# Altium schematic sheet 02MCU.SchDoc
size A3; SheetNumber: 2
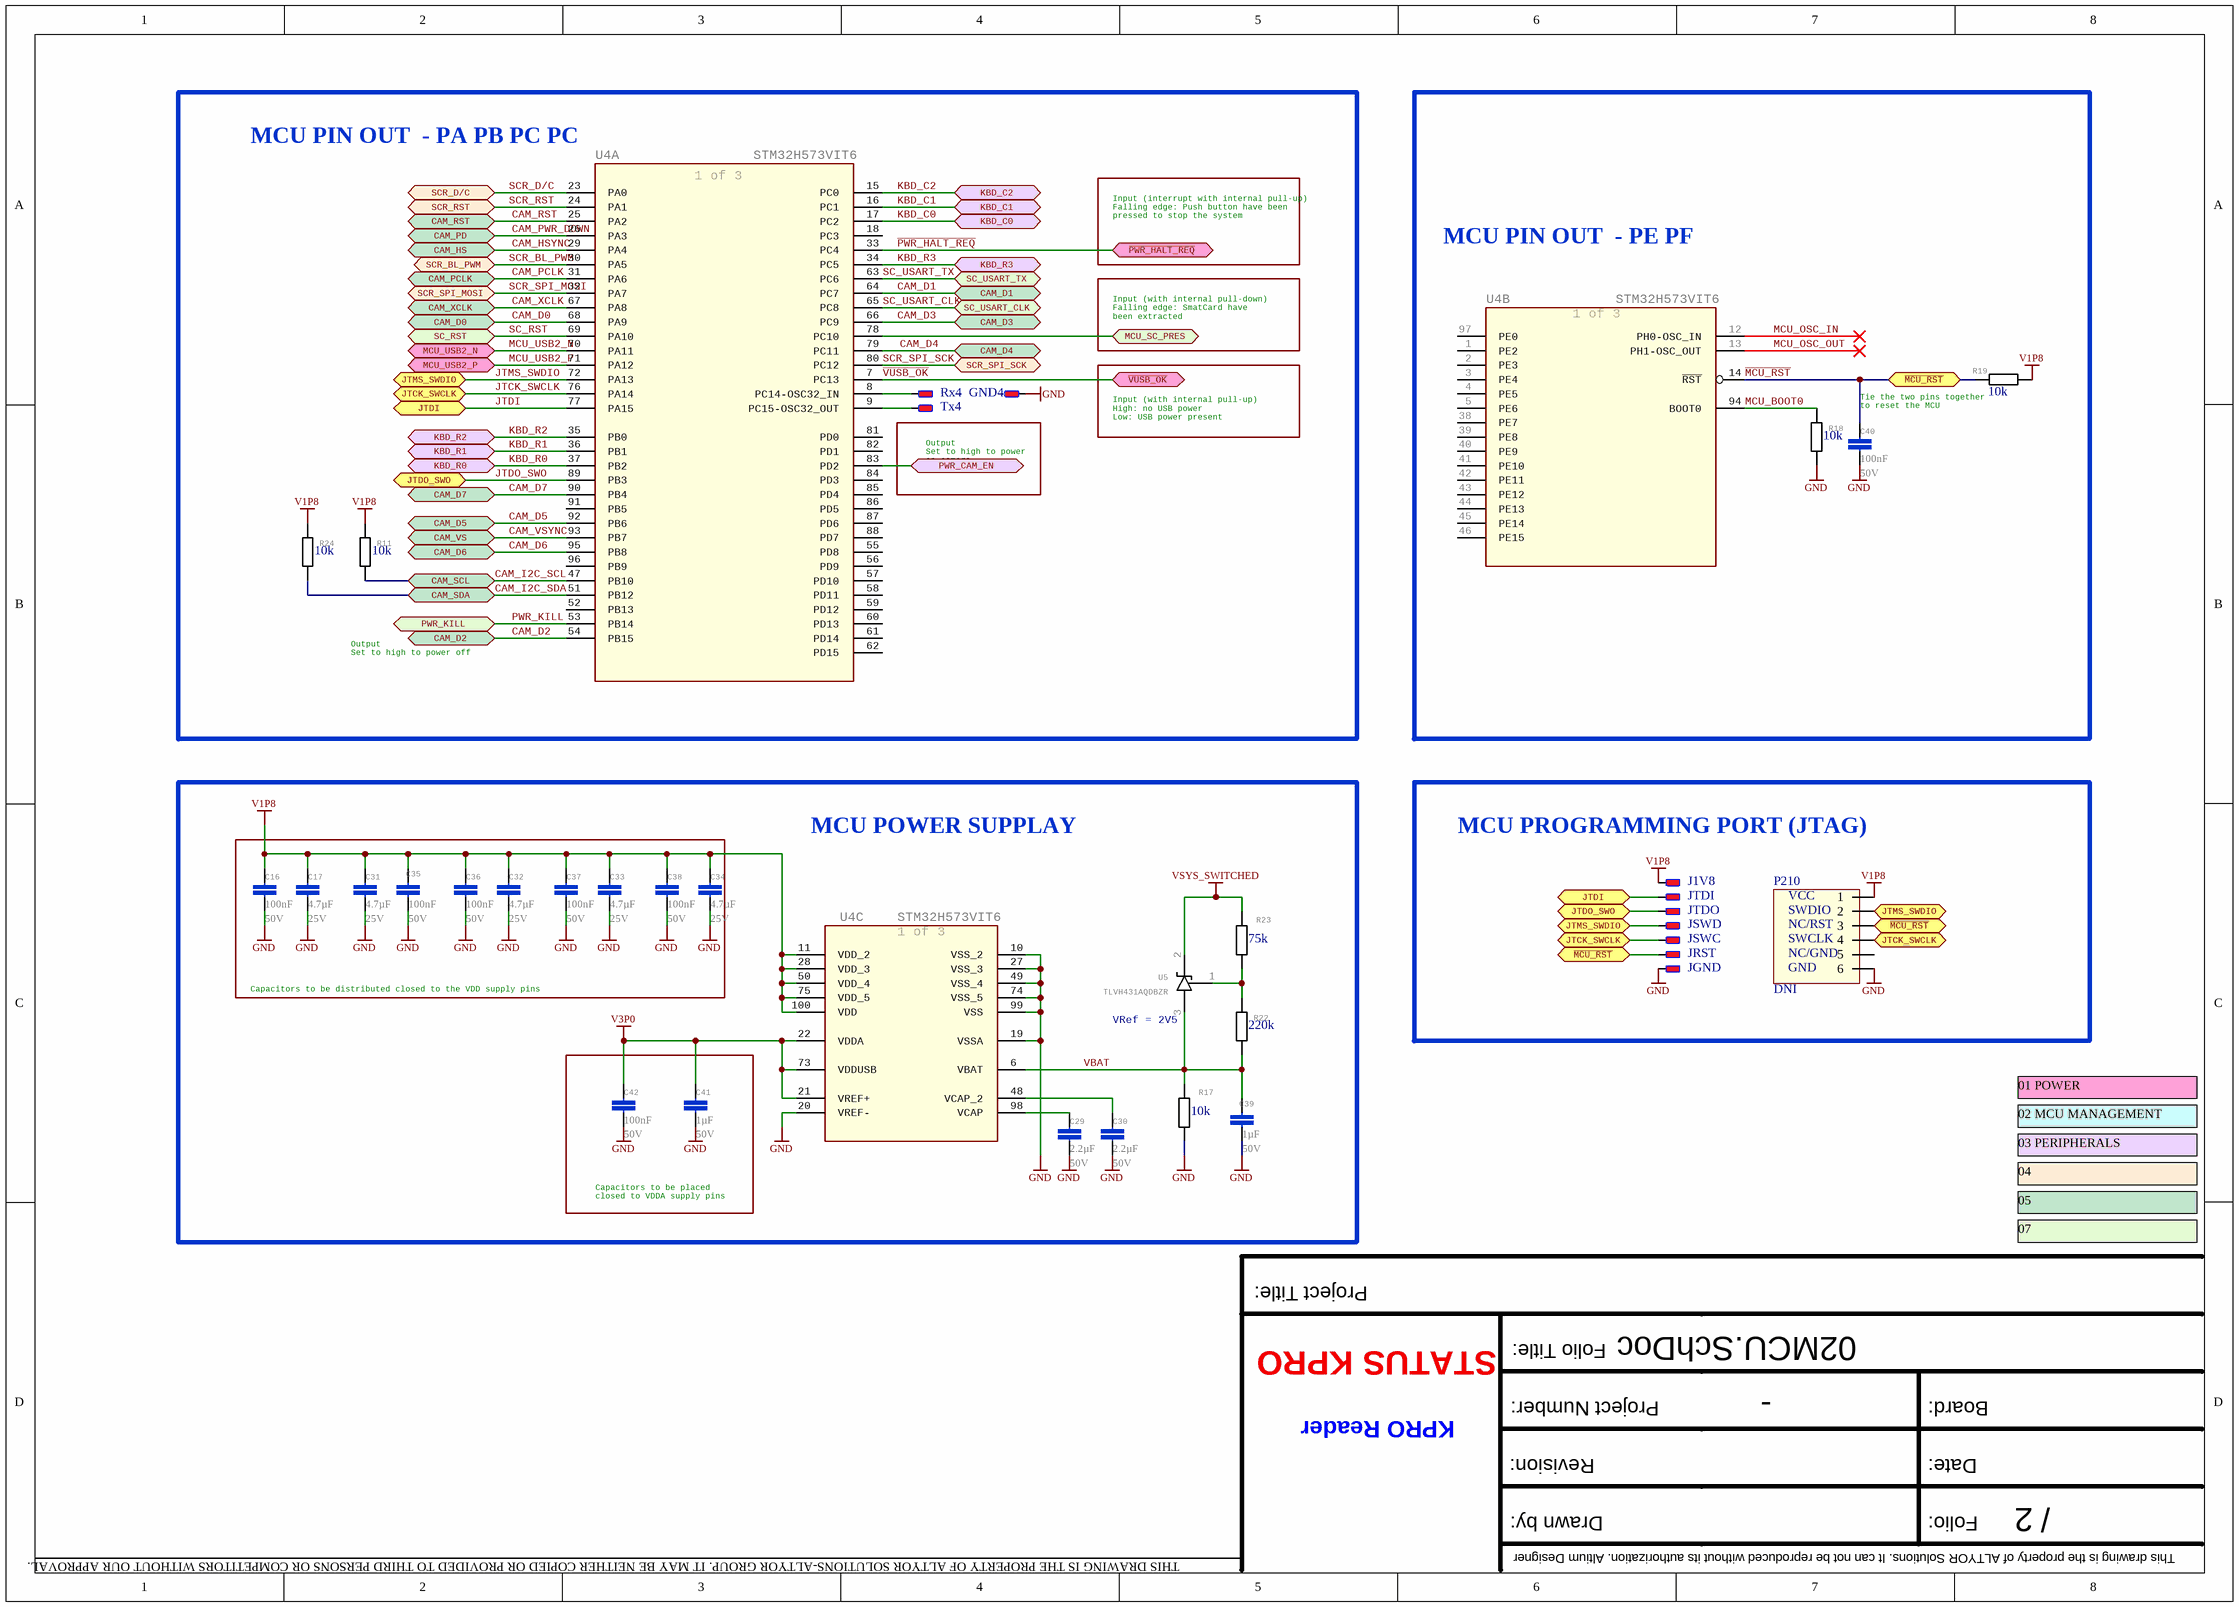
[diagram p0: 02MCU.SchDoc]

## Parts
C16  VOLTAGE: 50V  NAME: 100nF  [0402 - CAPACITOR]  (hidden comment: 0402B104K500CT)
C17  VOLTAGE: 25V  NAME: 4.7µF  [0805 - CAPACITOR]  (hidden comment: 0805X475M250CT)
C29  VOLTAGE: 50V  NAME: 2.2µF  [0805 - CAPACITOR]  (hidden comment: 805X225M500CT)
C30  VOLTAGE: 50V  NAME: 2.2µF  [0805 - CAPACITOR]  (hidden comment: 805X225M500CT)
C31  VOLTAGE: 25V  NAME: 4.7µF  [0805 - CAPACITOR]  (hidden comment: 0805X475M250CT)
C32  VOLTAGE: 25V  NAME: 4.7µF  [0805 - CAPACITOR]  (hidden comment: 0805X475M250CT)
C33  VOLTAGE: 25V  NAME: 4.7µF  [0805 - CAPACITOR]  (hidden comment: 0805X475M250CT)
C34  VOLTAGE: 25V  NAME: 4.7µF  [0805 - CAPACITOR]  (hidden comment: 0805X475M250CT)
C35  VOLTAGE: 50V  NAME: 100nF  [0402 - CAPACITOR]  (hidden comment: 0402B104K500CT)
C36  VOLTAGE: 50V  NAME: 100nF  [0402 - CAPACITOR]  (hidden comment: 0402B104K500CT)
C37  VOLTAGE: 50V  NAME: 100nF  [0402 - CAPACITOR]  (hidden comment: 0402B104K500CT)
C38  VOLTAGE: 50V  NAME: 100nF  [0402 - CAPACITOR]  (hidden comment: 0402B104K500CT)
C39  VOLTAGE: 50V  NAME: 1µF  [0603 - CAPACITOR]  (hidden comment: 0603X105K500CT)
C40  VOLTAGE: 50V  NAME: 100nF  [0402 - CAPACITOR]  (hidden comment: 0402B104K500CT)
C41  VOLTAGE: 50V  NAME: 1µF  [0603 - CAPACITOR]  (hidden comment: 0603X105K500CT)
C42  VOLTAGE: 50V  NAME: 100nF  [0402 - CAPACITOR]  (hidden comment: 0402B104K500CT)
GND4  TP  [TESTPOINT 1MM]  (value not drawn)  (no BOM)
J1V8  TP  [TESTPOINT 1MM]  (value not drawn)  (no BOM)
JGND  TP  [TESTPOINT 1MM]  (value not drawn)  (no BOM)
JRST  TP  [TESTPOINT 1MM]  (value not drawn)  (no BOM)
JSWC  TP  [TESTPOINT 1MM]  (value not drawn)  (no BOM)
JSWD  TP  [TESTPOINT 1MM]  (value not drawn)  (no BOM)
JTDI  TP  [TESTPOINT 1MM]  (value not drawn)  (no BOM)
JTDO  TP  [TESTPOINT 1MM]  (value not drawn)  (no BOM)
P210  NAME: DNI  [TC2030-MCP-NL-BOT]  (hidden comment: TC2030-MCP-NL)  (no BOM)
R11  NAME: 10k  [0402 - RESISTOR]  (hidden comment: RC0402FR-0710KL)
R17  NAME: 10k  [0402 - RESISTOR]  (hidden comment: RC0402FR-0710KL)
R18  NAME: 10k  [0402 - RESISTOR]  (hidden comment: RC0402FR-0710KL)
R19  NAME: 10k  [0402 - RESISTOR]  (hidden comment: RC0402FR-0710KL)
R22  NAME: 220k  [0402 - RESISTOR]  (hidden comment: RC0402FR-07220KL)
R23  NAME: 75k  [0402 - RESISTOR]  (hidden comment: RC0402FR-0775KL)
R24  NAME: 10k  [0402 - RESISTOR]  (hidden comment: RC0402FR-0710KL)
Rx4  TP  [TESTPOINT 1MM]  (value not drawn)  (no BOM)
Tx4  TP  [TESTPOINT 1MM]  (value not drawn)  (no BOM)
U4  STM32H573VIT6  1of3: 1 of 3  [LQFP-100]  (parts A,B,C of 3)
U5  TLVH431AQDBZR  [SOT23-VAR AB]

## Blocks framed on the sheet
MCU PIN OUT  - PA PB PC PC: GND4 R11 R24 Rx4 Tx4 U4
MCU PIN OUT  - PE PF: C40 R18 R19 U4
MCU POWER SUPPLAY: C29 C30 C39 C41 C42 R17 R22 R23 U4 U5
MCU PROGRAMMING PORT (JTAG): J1V8 JGND JRST JSWC JSWD JTDI JTDO P210
Capacitors to be distributed closed to the VDD supply pins: C16 C17 C31-C38

## Ports
CAM_D0, CAM_D1, CAM_D2, CAM_D3, CAM_D4, CAM_D5, CAM_D6, CAM_D7, CAM_HS, CAM_PCLK, CAM_PD, CAM_RST, CAM_SCL, CAM_SDA, CAM_VS, CAM_XCLK, JTCK_SWCLK, JTDI, JTDO_SWO, JTMS_SWDIO, KBD_C0, KBD_C1, KBD_C2, KBD_R0, KBD_R1, KBD_R2, KBD_R3, MCU_SC_PRES, MCU_USB2_N, MCU_USB2_P, PWR_CAM_EN, PWR_KILL, SC_RST, SC_USART_CLK, SC_USART_TX, SCR_BL_PWM, SCR_D/C, SCR_RST, SCR_SPI_MOSI, SCR_SPI_SCK, ~{MCU_RST}, ~{PWR_HALT_REQ}, ~{VUSB_OK}

## Nets
GND: C16.2 C17.2 C29.2 C30.2 C31.2 C32.2 C33.2 C34.2 C35.2 C36.2 C37.2 C38.2 C39.2 C40.2 C41.2 C42.2 GND4.1(PT) JGND.1(PT) P210.6 R17.1 R18.1 U4.10(VSS_2) U4.19(VSSA) U4.20(VREF-) U4.27(VSS_3) U4.49(VSS_4) U4.74(VSS_5) U4.99(VSS)
V1P8: C16.1 C17.1 C31.1 C32.1 C33.1 C34.1 C35.1 C36.1 C37.1 C38.1 J1V8.1(PT) P210.1 R11.2 R19.2 R24.2 U4.11(VDD_2) U4.28(VDD_3) U4.50(VDD_4) U4.75(VDD_5) U4.100(VDD)
V3P0: C41.1 C42.1 U4.21(VREF+) U4.22(VDDA) U4.73(VDDUSB)
VSYS_SWITCHED: R23.2 U5.2(K)
CAM_D0: U4.68(PA9) ; port CAM_D0
CAM_D1: U4.64(PC7) ; port CAM_D1
CAM_D2: U4.54(PB15) ; port CAM_D2
CAM_D3: U4.66(PC9) ; port CAM_D3
CAM_D4: U4.79(PC11) ; port CAM_D4
CAM_D5: U4.92(PB6) ; port CAM_D5
CAM_D6: U4.95(PB8) ; port CAM_D6
CAM_D7: U4.90(PB4) ; port CAM_D7
CAM_HSYNC: U4.29(PA4) ; port CAM_HS
CAM_I2C_SCL: R11.1 U4.47(PB10) ; port CAM_SCL
CAM_I2C_SDA: R24.1 U4.51(PB12) ; port CAM_SDA
CAM_PCLK: U4.31(PA6) ; port CAM_PCLK
CAM_PWR_DOWN: U4.26(PA3) ; port CAM_PD
CAM_RST: U4.25(PA2) ; port CAM_RST
CAM_VSYNC: U4.93(PB7) ; port CAM_VS
CAM_XCLK: U4.67(PA8) ; port CAM_XCLK
JTCK_SWCLK: JSWC.1(PT) P210.4 U4.76(PA14) ; port JTCK_SWCLK
JTDI: JTDI.1(PT) U4.77(PA15) ; port JTDI
JTDO_SWO: JTDO.1(PT) U4.89(PB3) ; port JTDO_SWO
JTMS_SWDIO: JSWD.1(PT) P210.2 U4.72(PA13) ; port JTMS_SWDIO
KBD_C0: U4.17(PC2) ; port KBD_C0
KBD_C1: U4.16(PC1) ; port KBD_C1
KBD_C2: U4.15(PC0) ; port KBD_C2
KBD_R0: U4.37(PB2) ; port KBD_R0
KBD_R1: U4.36(PB1) ; port KBD_R1
KBD_R2: U4.35(PB0) ; port KBD_R2
KBD_R3: U4.34(PC5) ; port KBD_R3
~{MCU_RST}: C40.1 JRST.1(PT) P210.3 R19.1 U4.14(~{RST}) ; port ~{MCU_RST}
MCU_BOOT0: R18.2 U4.94(BOOT0)
MCU_OSC_IN: U4.12(PH0-OSC_IN)
MCU_OSC_OUT: U4.13(PH1-OSC_OUT)
MCU_SC_PRES: U4.78(PC10) ; port MCU_SC_PRES
MCU_USB2_N: U4.70(PA11) ; port MCU_USB2_N
MCU_USB2_P: U4.71(PA12) ; port MCU_USB2_P
~{PWR_HALT_REQ}: U4.33(PC4) ; port ~{PWR_HALT_REQ}
PWR_CAM_EN: U4.83(PD2) ; port PWR_CAM_EN
PWR_KILL: U4.53(PB14) ; port PWR_KILL
SC_RST: U4.69(PA10) ; port SC_RST
SC_USART_CLK: U4.65(PC8) ; port SC_USART_CLK
SC_USART_TX: U4.63(PC6) ; port SC_USART_TX
SCR_BL_PWM: U4.30(PA5) ; port SCR_BL_PWM
SCR_D/C: U4.23(PA0) ; port SCR_D/C
SCR_RST: U4.24(PA1) ; port SCR_RST
SCR_SPI_MOSI: U4.32(PA7) ; port SCR_SPI_MOSI
SCR_SPI_SCK: U4.80(PC12) ; port SCR_SPI_SCK
~{VUSB_OK}: U4.7(PC13) ; port ~{VUSB_OK}
VBAT: C39.1 R17.2 R22.1 U4.6(VBAT) U5.3(A)
NetC29_1: C29.1 U4.98(VCAP)
NetC30_1: C30.1 U4.48(VCAP_2)
NetR22_2: R22.2 R23.1 U5.1(REF)
NetRx4_1: Rx4.1(PT) U4.8(PC14-OSC32_IN)
NetTx4_1: Tx4.1(PT) U4.9(PC15-OSC32_OUT)

Not connected (* = marked no-connect by the designer): P210 5; U4 1(PE2) 2(PE3) 3(PE4) 4(PE5) 5(PE6) 18(PC3) 38(PE7) 39(PE8) 40(PE9) 41(PE10) 42(PE11) 43(PE12) 44(PE13) 45(PE14) 46(PE15) 52(PB13) 55(PD8) 56(PD9) 57(PD10) 58(PD11) 59(PD12) 60(PD13) 61(PD14) 62(PD15) 81(PD0) 82(PD1) 84(PD3) 85(PD4) 86(PD5) 87(PD6) 88(PD7) 91(PB5) 96(PB9) 97(PE0)

## Notes on the sheet
- Input (interrupt with internal pull-up)
  Falling edge: Push button have been
  pressed to stop the system
- Input (with internal pull-down)
  Falling edge: SmatCard have
  been extracted
- (near R19) Tie the two pins together
  to reset the MCU
- Output
  Set to high to power
  on camera
- Input (with internal pull-up)
  High: no USB power
  Low: USB power present
- Output
  Set to high to power off
- (near U5) VRef = 2V5
- 01 POWER
- 02 MCU MANAGEMENT
- Capacitors to be placed
  closed to VDDA supply pins
- 03 PERIPHERALS
- 04
- 07
- 05
- STATUS KPRO
- Project Title:
- Folio Title:
- KPRO Reader
- Project Number:
- -
- Board:
- Revision:
- Date:
- THIS DRAWING IS THE PROPERTY OF ALTYOR SOLUTIONS-ALTYOR GROUP. IT MAY BE NEITHER COPIED OR PROVIDED TO THIRD PERSONS OR COMPETITORS WITHOUT OUR APPROVAL.
- Drawn by:
- Folio:
- /
- This drawing is the property of ALTYOR Solutions. It can not be reproduced without its authorization. Altium Designer
- (in symbol TC2030-MCP-NL) VCC; SWDIO; NC/RST; SWCLK; NC/GND; GND

## Library data of the parts
C16 C35-C38 C40 C42 = C-EU-C100NF-X7R-16V-0402: CAP X7R 100nF 50V ±10% 0402; MANUFACTURER: WALSIN; ARTICLE CODE: MSR 791-0402B104K500CT; GENERIC: True; ERP SF CODE: 4; ERP CODE: 10-*; TMAX: 125; TMIN: -55
C17 C31-C34 = C-EU-C4.7µF-X5R-6.3V-0805: CAP X5R 4.7µF 25V ±10% 0805; MANUFACTURER: WALSIN; ARTICLE CODE: MSR 791-0805X475M250CT; GENERIC: True; ERP SF CODE: 4; ERP CODE: 10-*; TMAX: 125; TMIN: -55
C29 C30 = C-EU-C2,2µF-X7R-16V-0805: CAP X5R 2.2µF 50V ±10% 0805; MANUFACTURER: WALSIN; ARTICLE CODE: MSR 791-805X225M500CT; GENERIC: True; ERP SF CODE: 4; ERP CODE: 10-*; TMAX: 125; TMIN: -55
C39 C41 = C-EU-C1µF-X5R-6.3V-0603: CAP X5R 1µF 50V ±10% 0603; MANUFACTURER: WALSIN; ARTICLE CODE: MSR 791-0603X105K500CT; GENERIC: True; ERP SF CODE: 4; ERP CODE: 10-*; TMAX: 125; TMIN: -55
GND4 J1V8 JGND JRST JSWC JSWD JTDI JTDO Rx4 Tx4 = TP: Pointe de test 1.27mm; LIBRARY REFERENCE: TP 1.27mm; NAME: 1.27; ERP CODE: 10-*; ERP SF CODE: 16; GENERIC: False; TMAX: N/A; TMIN: N/A
P210 = TC2030-MCP-NL: Connecteur Tag Connect - 6pts RJ45; ARTICLE CODE: DIG TC2030-MCP-NL-10-ND; ERP CODE: 10-*; ERP SF CODE: 11; GENERIC: False; MANUFACTURER: TAG CONNECT; TMAX: N/A; TMIN: N/A
R11 R17-R19 R24 = R-EU-R10K-1%-0402: RES 10k 63mW 1% 0402; MANUFACTURER: YAGEO; ARTICLE CODE: MSR 603-RC0402FR-0710KL; GENERIC: True; TMIN: -55; TMAX: 150
R22 = R-EU-R220K-1%-0402: RES 220k 63mW 1% 0402; MANUFACTURER: YAGEO; ARTICLE CODE: MSR 603-RC0402FR-07220KL; GENERIC: True; TMIN: -55; TMAX: 150
R23 = R-EU-R75K-1%-0402: RES 75k 63mW 1% 0402; MANUFACTURER: YAGEO; ARTICLE CODE: MSR 603-RC0402FR-0775KL; GENERIC: True; TMIN: -55; TMAX: 150
U4 = STM32H573VIT6: Arm Â® Cortex Â® -M33 32-bit MCU+TrusZoneÂ® + FPU, 375 DMIPS 250 MHz, 2-Mbyte flash memory, 640 Kbytes RAM, Crypt; MANUFACTURER: STMicroelectronics; GENERIC: False; TMAX: 125; ARTICLE CODE: MSR 511-STM32H573VIT6; TMIN: -40; REFERENCE: STM32H573VIT6; NAME: STM32H573
U5 = TLVH431AQDBZR: Low voltage adjustable 1.5% precision shunt regulators, SOT23; MANUFACTURER: TEXAS; GENERIC: G$1; TMAX: 125; ARTICLE CODE: MSR 595-TLVH431AQDBZR; ERP CODE: 10-*; TMIN: -40; NAME: TLVH431